# EAGLE design touch (EAGLE 9.6.2)
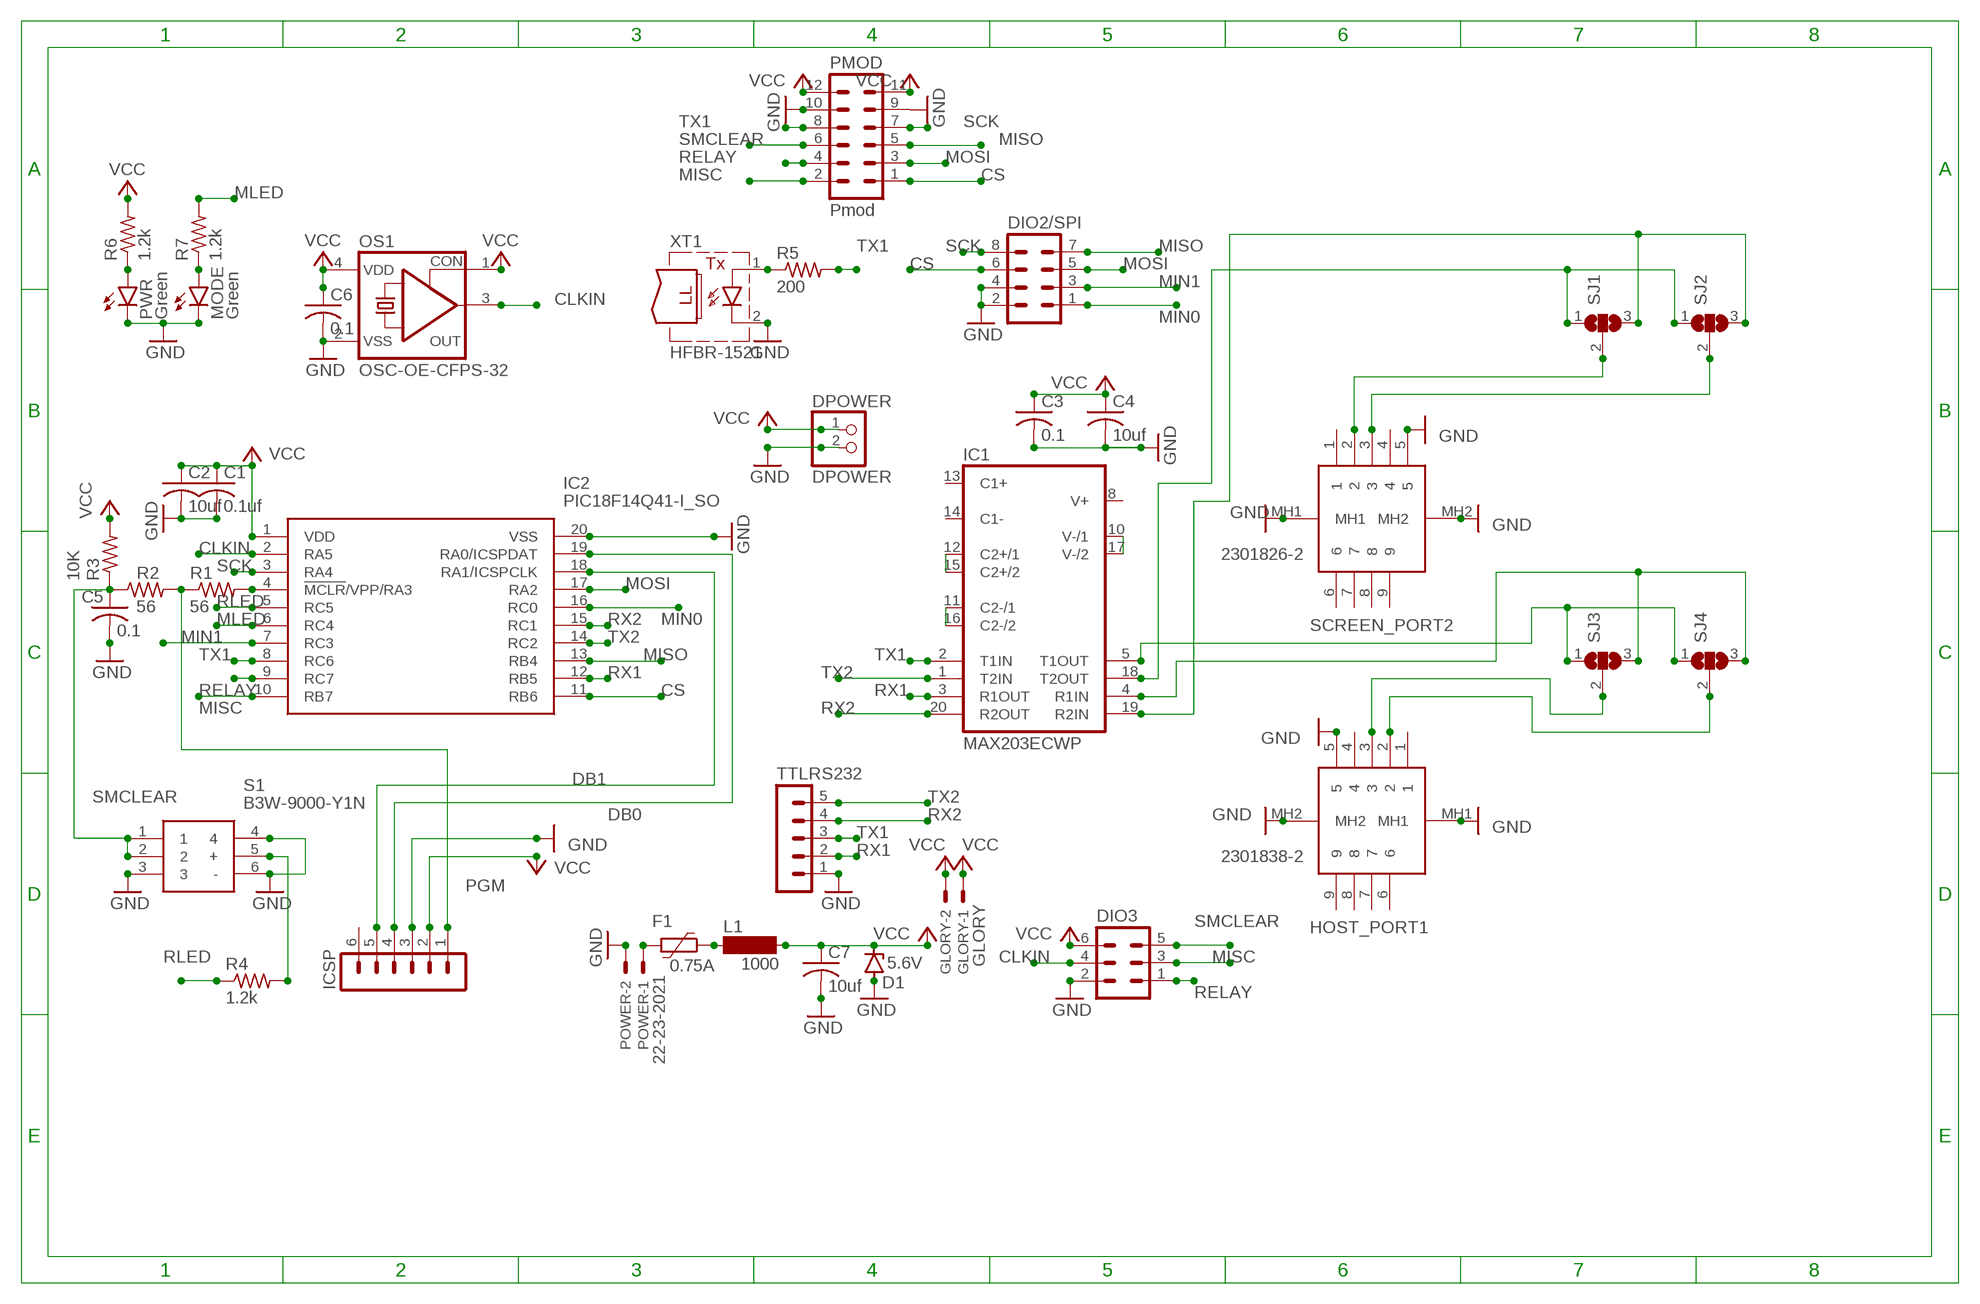
[diagram p0: schematic, sheet 1]

## Parts
C1  0.1uf  C-USC0805  [C0805]
C2  10uf  C-USC0805  [C0805]
C3  0.1  C-USC0805  [C0805]
C4  10uf  C-USC0805  [C0805]
C5  0.1  C-USC0805  [C0805]
C6  0.1  C-USC0805  [C0805]
C7  10uf  C-USC0805  [C0805]
D1  5.6V  ZENER-DIODESMB  [SMB]
DIO2/SPI  MA04-2  [MA04-2]
DIO3  MA03-2  [MA03-2]
DPOWER  DPOWER  PINHD-1X2  [1X02]
F1  0.75A  1206L075SL  [1206L]
GLORY  GLORY  22-23-2021  [22-23-2021]
HOST_PORT1  2301838-2  [23018382]
IC1  MAX203ECWP  [SO20L]
IC2  PIC18F14Q41-I_SO  [SOIC127P1030X265-20N]
ICSP  MA06-1  [MA06-1]
L1  1000  SM-1206  [SM-1206]
MODE  Green  LEDCHIPLED_1206  [CHIPLED_1206]
OS1  OSC-OE-CFPS-32  [7.2X5.2-4-PAD]
PMOD  Pmod  MA06-2  [MA06-2]
POWER  22-23-2021  [22-23-2021]
PWR  Green  LEDCHIPLED_1206  [CHIPLED_1206]
R1  56  R-US_R0805  [R0805]
R2  56  R-US_R0805  [R0805]
R3  10K  R-US_R0805  [R0805]
R4  1.2k  R-US_R0805  [R0805]
R5  200  R-US_R0805  [R0805]
R6  1.2k  R-US_R0805  [R0805]
R7  1.2k  R-US_R0805  [R0805]
S1  B3W-9000-Y1N  [B3W-9_1-LED]
SCREEN_PORT2  2301826-2  [23018262]
SJ1  SJ2W  [SJ_2]
SJ2  SJ2W  [SJ_2]
SJ3  SJ2W  [SJ_2]
SJ4  SJ2W  [SJ_2]
TTLRS232  MA05-1  [MA05-1]
XT1  HFBR-1521  [HFBR-15X3]

## Nets
CLKIN: DIO3.4 IC2.2(RA5) OS1.3(OUT)
CS: DIO2/SPI.6 IC2.11(RB6) PMOD.1
DB0: IC2.19(RA0/ICSPDAT) ICSP.4
DB1: IC2.18(RA1/ICSPCLK) ICSP.5
GND [icurrent]: C1.2 C2.2 C3.2 C4.2 C5.2 C6.2 C7.2 D1.A DIO2/SPI.2 DIO2/SPI.4 DIO3.2 DPOWER.2 HOST_PORT1.5 HOST_PORT1.MH1 HOST_PORT1.MH2 IC2.20(VSS) ICSP.3 MODE.C OS1.2(VSS) PMOD.9 PMOD.10 POWER.2 PWR.C S1.3 S1.4 S1.6(-) SCREEN_PORT2.5 SCREEN_PORT2.MH1 SCREEN_PORT2.MH2 TTLRS232.1 XT1.2(C)
MIN0: DIO2/SPI.1 IC2.16(RC0)
MIN1: DIO2/SPI.3 IC2.7(RC3)
MISC: DIO3.3 IC2.10(RB7) PMOD.2
MISO: DIO2/SPI.7 IC2.13(RB4) PMOD.5
MLED: IC2.6(RC4) R7.2
MOSI: DIO2/SPI.5 IC2.17(RA2) PMOD.3
N$1: SCREEN_PORT2.3 SJ2.2
N$2: SCREEN_PORT2.2 SJ1.2
N$3: HOST_PORT1.2 SJ4.2
N$4: HOST_PORT1.3 SJ3.2
N$5: IC1.12(C2+/1) IC1.15(C2+/2)
N$6: IC1.11(C2-/1) IC1.16(C2-/2)
N$7: IC1.10(V-/1) IC1.17(V-/2)
N$8: IC1.5(T1OUT) SJ3.1 SJ4.1
N$9: IC1.4(R1IN) SJ3.3 SJ4.3
N$11: IC1.18(T2OUT) SJ1.1 SJ2.1
N$12: IC1.19(R2IN) SJ1.3 SJ2.3
N$14: IC2.4(!MCLR!/VPP/RA3) R1.2
N$16 [icurrent]: F1.2 POWER.1
N$17: MODE.A R7.1
N$18: R4.2 S1.5(+)
N$19: R5.1 XT1.1(A)
N$20 [icurrent]: F1.1 L1.1
N$21: PWR.A R6.1
PGM: ICSP.1 R1.1 R2.2
RELAY: DIO3.1 IC2.9(RC7) PMOD.4
RLED: IC2.5(RC5) R4.1
RX1: IC1.3(R1OUT) IC2.12(RB5) TTLRS232.2
RX2: IC1.20(R2OUT) IC2.15(RC1) TTLRS232.4
SCK: DIO2/SPI.8 IC2.3(RA4) PMOD.7
SMCLEAR: C5.1 DIO3.5 PMOD.6 R2.1 R3.1 S1.1 S1.2
TX1: IC1.2(T1IN) IC2.8(RC6) PMOD.8 R5.2 TTLRS232.3
TX2: IC1.1(T2IN) IC2.14(RC2) TTLRS232.5
VCC [icurrent]: C1.1 C2.1 C3.1 C4.1 C6.1 C7.1 D1.C DIO3.6 DPOWER.1 GLORY.1 GLORY.2 IC2.1(VDD) ICSP.2 L1.2 OS1.1(CON) OS1.4(VDD) PMOD.11 PMOD.12 R3.2 R6.2
Unconnected: HOST_PORT1.1 HOST_PORT1.4 HOST_PORT1.6 HOST_PORT1.7 HOST_PORT1.8 HOST_PORT1.9 IC1.8(V+) IC1.13(C1+) IC1.14(C1-) ICSP.6 SCREEN_PORT2.1 SCREEN_PORT2.4 SCREEN_PORT2.6 SCREEN_PORT2.7 SCREEN_PORT2.8 SCREEN_PORT2.9

## Power pins joined to a net without a drawn wire
GND: IC1.6(GND) IC1.9(GND)
VCC: IC1.7(VCC)

## Library data of the parts
C1-C7 = rcl:C-US: CAPACITOR, American symbol; SPICEPREFIX: C
D1 = diode:ZENER-DIODE: Z-Diode
DIO2/SPI = con-lstb:MA04-2: PIN HEADER; OC_FARNELL: unknown; OC_NEWARK: unknown
DIO3 = con-lstb:MA03-2: PIN HEADER; OC_FARNELL: unknown; OC_NEWARK: unknown
DPOWER = pinhead:PINHD-1X2: PIN HEADER
F1 = polyfuse-smd_10:?: Polyfuse Resettable PTC Source: http://www.littelfuse.com/products/resettable-ptcs.aspx; MF: Littelfuse; MPN: 1206L075SL; OC_FARNELL: unknown; OC_NEWARK: 91T3236
GLORY POWER = con-molex:22-23-2021: .100" (2.54mm) Center Header - 2 Pin; MF: MOLEX; MPN: 22-23-2021; OC_FARNELL: 1462926; OC_NEWARK: 25C3832
HOST_PORT1 = SamacSys_Parts:2301838-2: TE CONNECTIVITY - 2301838-2 - D Sub Connector, DB9, Standard, Receptacle, 9 Contacts, DE, Solder Source: Datasheet <https://www.te.com/global-en/product-2301838-2.datasheet.pdf>; DESCRIPTION: TE CONNECTIVITY - 2301838-2 - D Sub Connector, DB9, Standard, Receptacle, 9 Contacts, DE, Solder; HEIGHT: mm; MANUFACTURER_NAME: TE Connectivity; MANUFACTURER_PART_NUMBER: 2301838-2; MOUSER_PART_NUMBER: 571-2301838-2; MOUSER_PRICE-STOCK: https://www.mouser.co.uk/ProductDetail/TE-Connectivity/2301838-2?qs=YCa%2FAAYMW00TbWYD0LSiFQ%3D%3D
IC1 = maxim:MAX203ECWP: RS232 TRANSCEIVER; MPN: MAX203ECWP+G36; OC_FARNELL: 1224204; OC_NEWARK: 89K3435
IC2 = SamacSys_Parts:PIC18F14Q41-I_SO: 8-bit Microcontrollers - MCU Op Amp, 16KB Flash, 1K RAM, 512 EEPROM, 12b ADCC, 8b DAC, DMA, 16-bit PWM, PPS, UART, SPI/I2C Source: Datasheet <https://componentsearchengine.com/Datasheets/2/PIC18F14Q41-I_SO.pdf>; DESCRIPTION: 8-bit Microcontrollers - MCU Op Amp, 16KB Flash, 1K RAM, 512 EEPROM, 12b ADCC, 8b DAC, DMA, 16-bit PWM, PPS, UART, SPI/I2C; HEIGHT: 2.65mm; MANUFACTURER_NAME: Microchip; MANUFACTURER_PART_NUMBER: PIC18F14Q41-I/SO; MOUSER_PART_NUMBER: 579-PIC18F14Q41-I/SO; MOUSER_PRICE-STOCK: https://www.mouser.co.uk/ProductDetail/Microchip-Technology/PIC18F14Q41-I-SO?qs=W%2FMpXkg%252BdQ5jNCMT7LkJWg%3D%3D
ICSP = con-lstb:MA06-1: PIN HEADER; OC_FARNELL: unknown; OC_NEWARK: unknown
L1 = inductor-neosid:SM-1206: INDUCTOR SMD chip inductor; OC_FARNELL: unknown; OC_NEWARK: unknown
MODE PWR = led:LED: LED OSRAM: - CHIPLED LG R971, LG N971, LY N971, LG Q971, LY Q971, LO R971, LY R971 LH N974, LH R974 LS Q976, LO Q976, LY Q976 LO Q996 - Hyper CHIPLED LW Q18S LB Q993, LB Q99A, LB R99A - SideLED LS A670, LO A670, LY A670, LG A670, LP A670 LB A673, LV A673, LT A673, LW A673 LH A674 LY A675 LS A676, LA A676, LO A676, LY A676, LW A676 LS A679, LY A679, LG A679 - Hyper Micro SIDELED® LS Y876, LA Y876, LO Y876, LY Y876 LT Y87S - SmartLED LW L88C, LW L88S LB L89C, LB L89S, LG L890 LS L89K, LO L89K, LY L89K LS L896, LA L896, LO L896, LY L896 - TOPLED LS T670, LO T670, LY T670, LG T670, LP T670 LSG T670, LSP T670, LSY T670, LOP T670, LYG T670 LG T671, LOG T671, LSG T671 LB T673, LV T673, LT T673, LW T673 LH T674 LS T676, LA T676, LO T676, LY T676, LB T676, LH T676, LSB T676, LW T676 LB T67C, LV T67C, LT T67C, LS T67K, LO T67K, LY T67K, LW E67C LS E67B, LA E67B, LO E67B, LY E67B, LB E67C, LV E67C, LT E67C LW T67C LS T679, LY T679, LG T679 LS T770, LO T770, LY T770, LG T770, LP T770 LB T773, LV T773, LT T773, LW T773 LH T774 LS E675, LA E675, LY E675, LS T675 LS T776, LA T776, LO T776, LY T776, LB T776 LHGB T686 LT T68C, LB T68C - Hyper Mini TOPLED® LB M676 - Mini TOPLED Santana® LG M470 LS M47K, LO M47K, LY M47K Source: http://www.osram.convergy.de LUXEON: - LUMILED® LXK2-PW12-R00, LXK2-PW12-S00, LXK2-PW14-U00, LXK2-PW14-V00 LXK2-PM12-R00, LXK2-PM12-S00, LXK2-PM14-U00 LXK2-PE12-Q00, LXK2-PE12-R00, LXK2-PE12-S00, LXK2-PE14-T00, LXK2-PE14-U00 LXK2-PB12-K00, LXK2-PB12-L00, LXK2-PB12-M00, LXK2-PB14-N00, LXK2-PB14-P00, LXK2-PB14-Q00 LXK2-PR12-L00, LXK2-PR12-M00, LXK2-PR14-Q00, LXK2-PR14-R00 LXK2-PD12-Q00, LXK2-PD12-R00, LXK2-PD12-S00 LXK2-PH12-R00, LXK2-PH12-S00 LXK2-PL12-P00, LXK2-PL12-Q00, LXK2-PL12-R00 Source: www.luxeon.com KINGBRIGHT: KA-3528ASYC Source: www.kingbright.com
OS1 = IQD-Frequency-Products:OSC-OE: OSCILLATOR WITH OE
PMOD = con-lstb:MA06-2: PIN HEADER; OC_FARNELL: unknown; OC_NEWARK: unknown
R1-R7 = rcl:R-US_: RESISTOR, American symbol; SPICEPREFIX: R
S1 = SamacSys_Parts:B3W-9000-Y1N: Illuminated Tactile Switches Illuminated Ylw LED White Cap Source: Datasheet <http://www.mouser.com/ds/2/307/en-b3w-9-11824.pdf>; ALLIED_NUMBER: 70176005; ALLIED_PRICE-STOCK: https://www.alliedelec.com/omron-electronic-components-b3w-9000-y1n/70176005/; DESCRIPTION: Illuminated Tactile Switches Illuminated Ylw LED White Cap; HEIGHT: mm; MANUFACTURER_NAME: Omron Electronics; MANUFACTURER_PART_NUMBER: B3W-9000-Y1N; MOUSER_PART_NUMBER: 653-B3W-9000-Y1N; MOUSER_PRICE-STOCK: https://www.mouser.com/Search/Refine.aspx?Keyword=653-B3W-9000-Y1N; RS_PART_NUMBER: 0492777P; RS_PRICE-STOCK: http://uk.rs-online.com/web/p/products/0492777P
SCREEN_PORT2 = SamacSys_Parts:2301826-2: D-Sub Standard Connectors AMPL PLUG HD20 VERT 9P, B/L,4-40 S/LOC Source: Datasheet <https://componentsearchengine.com/Datasheets/1/2301826-2.pdf>; DESCRIPTION: D-Sub Standard Connectors AMPL PLUG HD20 VERT 9P, B/L,4-40 S/LOC; HEIGHT: 12.48mm; MANUFACTURER_NAME: TE Connectivity; MANUFACTURER_PART_NUMBER: 2301826-2; MOUSER_PART_NUMBER: 571-2301826-2; MOUSER_PRICE-STOCK: https://www.mouser.co.uk/ProductDetail/TE-Connectivity/2301826-2?qs=YCa%2FAAYMW01innH%2F05o6MQ%3D%3D
SJ1-SJ4 = jumper:SJ2W: SMD solder JUMPER
TTLRS232 = con-lstb:MA05-1: PIN HEADER; OC_FARNELL: unknown; OC_NEWARK: unknown
XT1 = fiber-optic-hp:HFBR-1521: TRANSMITTER low cost miniature fiber optic component, 5-MBd high performance link, vertical; MF: AGILENT TECHNOLOGIES; MPN: HFBR-1521; OC_FARNELL: 1173128; OC_NEWARK: 06F6050

## Net classes
1 icurrent: width 0.305 mm

## Board
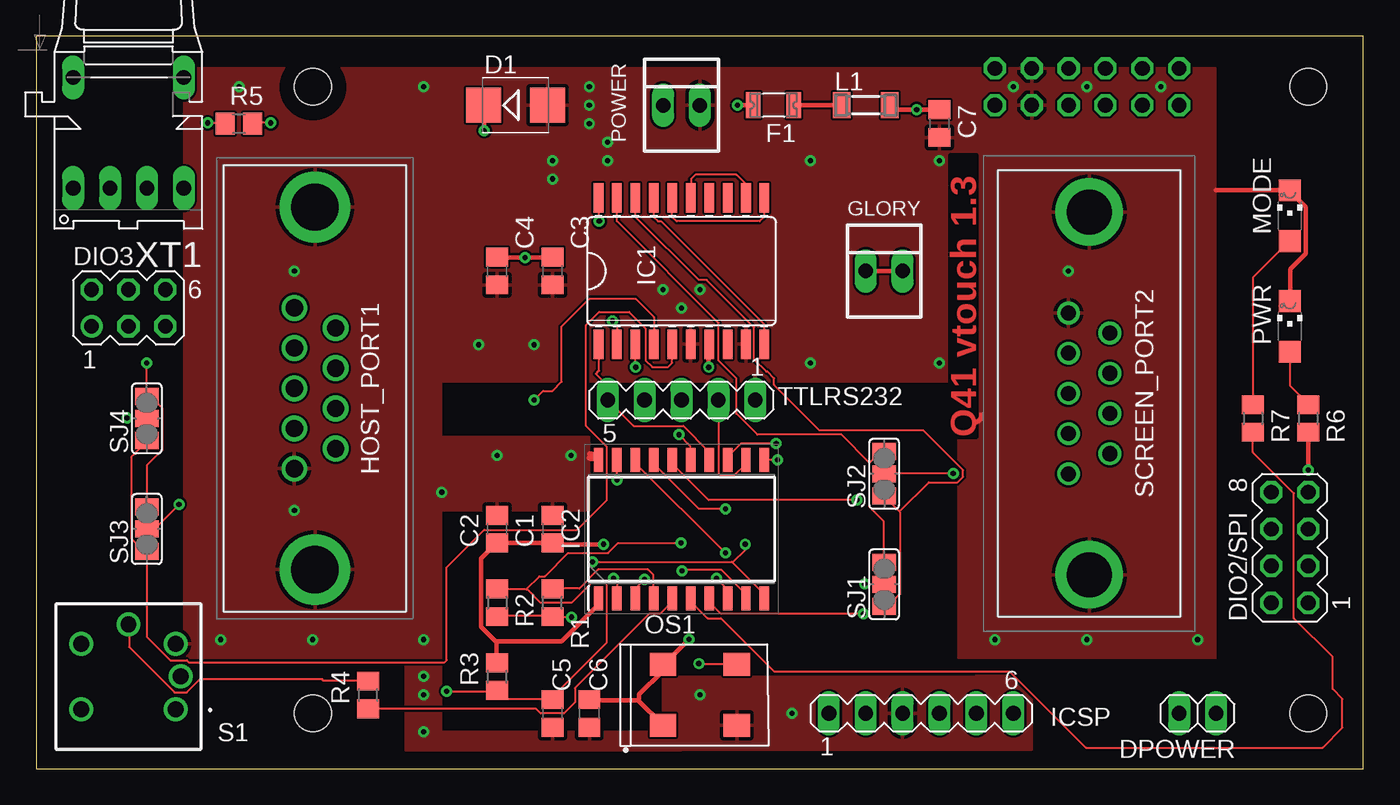
[diagram p1: board, top side]
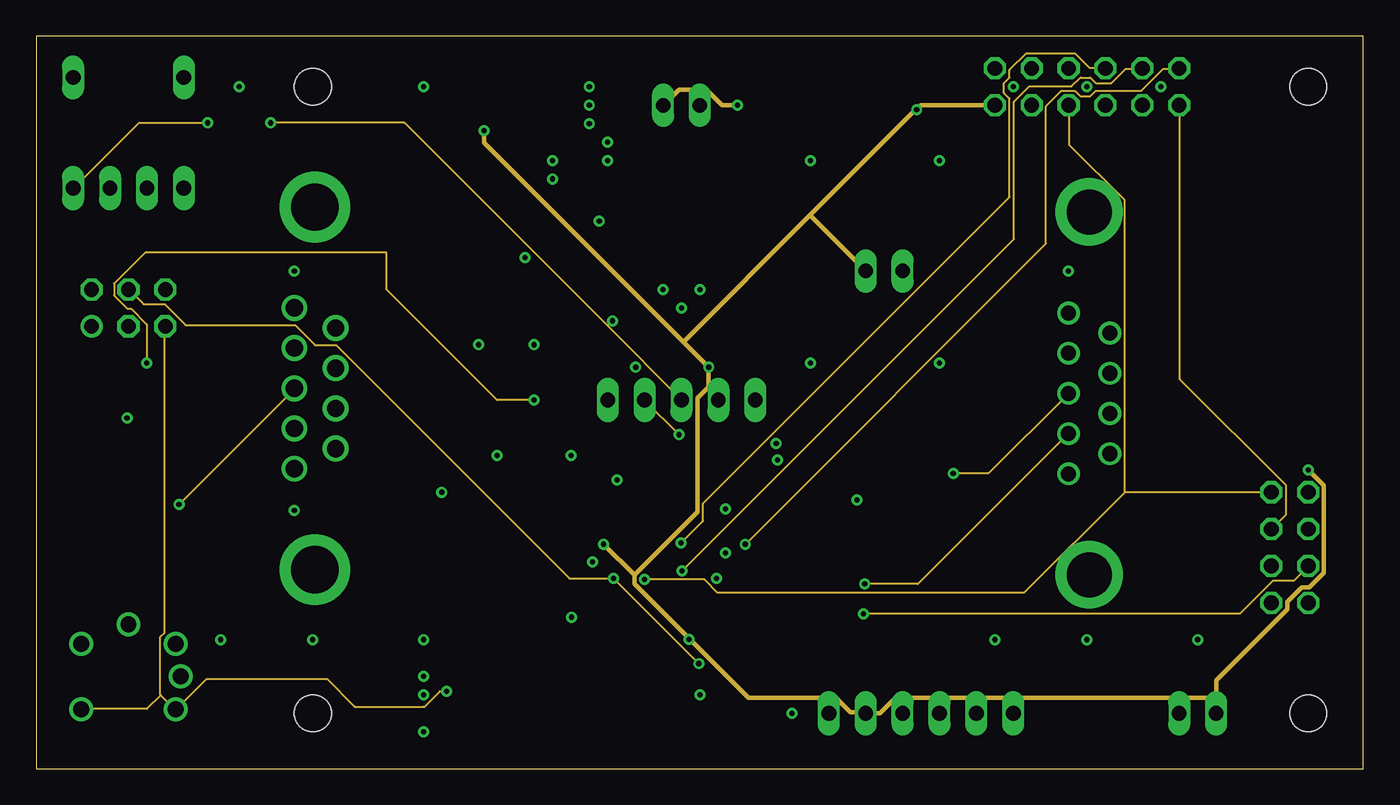
[diagram p2: board, inner layer Route2]
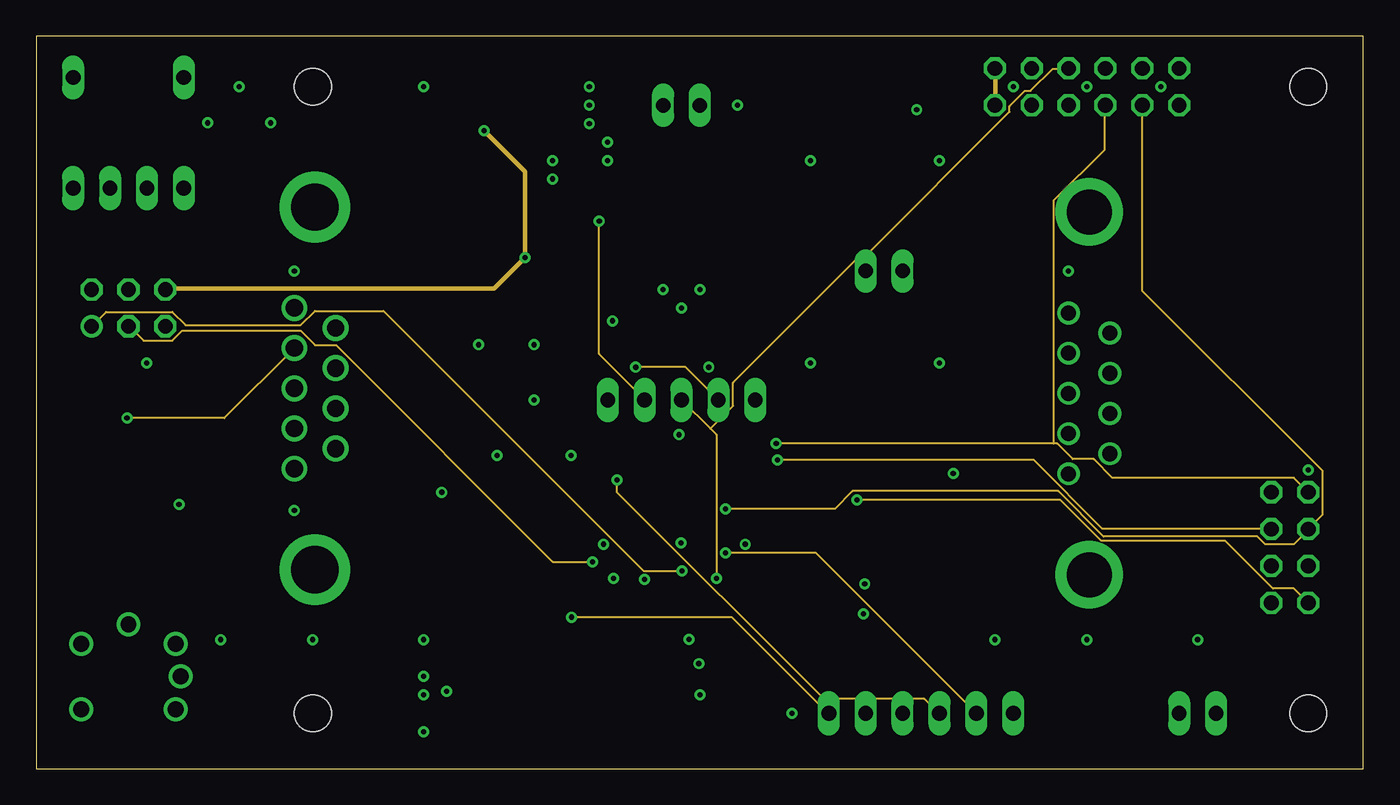
[diagram p3: board, inner layer Route15]
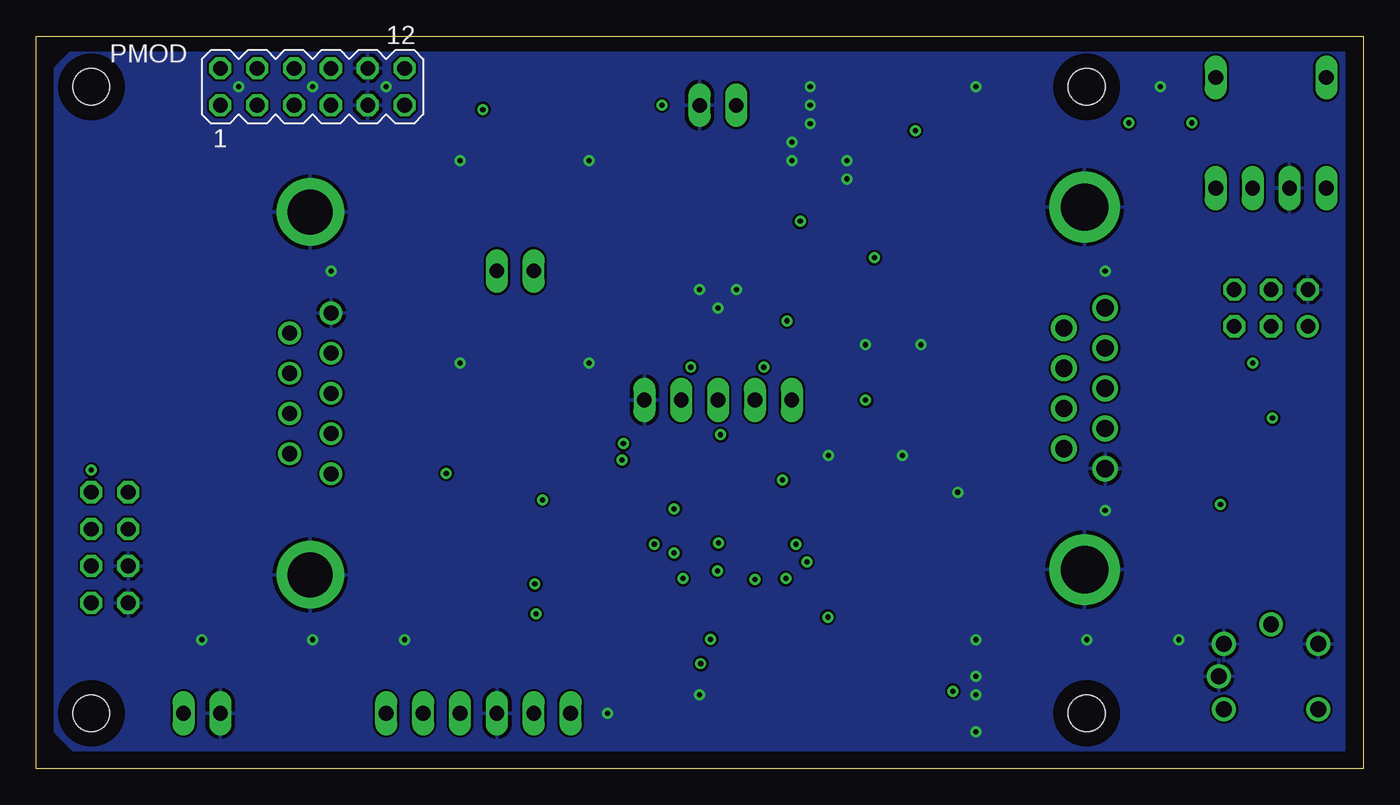
[diagram p4: board, bottom side, seen from below]

Size 91.42 x 50.47 mm. Coordinates in mm from the lower left corner, seen from the top.
Outline: 0,0 91.42,0 91.42,50.47 0,50.47 0,0
Copper layers (1+2*15+16): Top 0.035mm / dielectric 1.5mm / Route2 0.035mm / dielectric 0.15mm / Route15 0.035mm / dielectric 0.2mm / Bottom 0.035mm
Design rules "default *": minimum track width 6mil, minimum drill 0.35mm, track to track 6mil, track to pad 6mil, pad to pad 6mil, via to via 6mil, smd to smd 6mil, copper to edge 40mil, drill to drill 6mil, minimum pad ring 10mil, minimum via ring 8mil, stop-mask expansion 4mil, vias tented up to drill 0mil, thermal gap 10mil
Holes 2.54 mm at 19.05,46.99 19.05,3.81 87.63,3.81 87.63,46.99

### Footprints (pad centres in the part's own frame; a part is rotated, then mirrored left to right if it is on the bottom)
C0805 = smd 1.3 x 1.5: 1 -0.95,0; 2 0.95,0
SMB = smd 2.4 x 2.4: A 2.2,0; C -2.2,0
MA04-2 = drill 1.016 octagon: 1 -3.81,-1.27; 2 -3.81,1.27; 3 -1.27,-1.27; 4 -1.27,1.27; 5 1.27,-1.27; 6 1.27,1.27; 7 3.81,-1.27; 8 3.81,1.27
MA03-2 = drill 1.016: 1 -2.54,-1.27 | drill 1.016 octagon: 2 -2.54,1.27; 3 0,-1.27; 4 0,1.27; 5 2.54,-1.27; 6 2.54,1.27
1X02 = drill 1.016 long: 1 -1.27,0; 2 1.27,0
1206L = smd 1 x 1.8: 1 -1.4,0; 2 1.4,0
22-23-2021 = drill 1 long: 1 -1.27,0; 2 1.27,0
23018382 = drill 1.19 pad 1.785: 1 0,0; 2 -2.77,0; 3 -5.54,0; 4 -8.31,0; 5 -11.08,0; 6 -1.385,-2.84; 7 -4.155,-2.84; 8 -6.925,-2.84; 9 -9.695,-2.84 | drill 3.25 pad 4.875: MH1 6.955,-1.42; MH2 -18.035,-1.42
SO20L = smd 0.66 x 2.032: 1 -5.715,-5.029; 2 -4.445,-5.029; 3 -3.175,-5.029; 4 -1.905,-5.029; 5 -0.635,-5.029; 6 0.635,-5.029; 7 1.905,-5.029; 8 3.175,-5.029; 9 4.445,-5.029; 10 5.715,-5.029; 11 5.715,5.029; 12 4.445,5.029; 13 3.175,5.029; 14 1.905,5.029; 15 0.635,5.029; 16 -0.635,5.029; 17 -1.905,5.029; 18 -3.175,5.029; 19 -4.445,5.029; 20 -5.715,5.029
SOIC127P1030X265-20N = smd 1.65 x 0.65: 1 -4.775,5.715; 2 -4.775,4.445; 3 -4.775,3.175; 4 -4.775,1.905; 5 -4.775,0.635; 6 -4.775,-0.635; 7 -4.775,-1.905; 8 -4.775,-3.175; 9 -4.775,-4.445; 10 -4.775,-5.715; 11 4.775,-5.715; 12 4.775,-4.445; 13 4.775,-3.175; 14 4.775,-1.905; 15 4.775,-0.635; 16 4.775,0.635; 17 4.775,1.905; 18 4.775,3.175; 19 4.775,4.445; 20 4.775,5.715
MA06-1 = drill 1.016 long: 1 -6.35,0; 2 -3.81,0; 3 -1.27,0; 4 1.27,0; 5 3.81,0; 6 6.35,0
SM-1206 = smd 1.2 x 1.8: 1 -1.65,0; 2 1.65,0
CHIPLED_1206 = smd 1.5 x 1.5: A 0,-1.75; C 0,1.75
7.2X5.2-4-PAD = smd 1.8 x 1.6: 1 -2.54,-2.1; 2 2.54,-2.1; 3 2.54,2.1; 4 -2.54,2.1
MA06-2 = drill 1.016 octagon: 1 -6.35,-1.27; 2 -6.35,1.27; 3 -3.81,-1.27; 4 -3.81,1.27; 5 -1.27,-1.27; 6 -1.27,1.27; 7 1.27,-1.27; 8 1.27,1.27; 9 3.81,-1.27; 10 3.81,1.27; 11 6.35,-1.27; 12 6.35,1.27
R0805 = smd 1.3 x 1.5: 1 -0.95,0; 2 0.95,0
B3W-9_1-LED = drill 1.1 pad 1.65: 1 3.25,-2.25; 2 -3.25,-2.25; 3 3.25,2.25; 4 -3.25,2.25; 5 0,3.6; 6 3.6,0
23018262 = drill 1.04 pad 1.56: 1 0,0; 2 2.77,0; 3 5.54,0; 4 8.31,0; 5 11.08,0; 6 1.385,-2.84; 7 4.155,-2.84; 8 6.925,-2.84; 9 9.695,-2.84 | drill 3.1 pad 4.65: MH1 -6.955,-1.42; MH2 18.035,-1.42
SJ_2 = smd 1.168 x 1.6: 1 -1.524,0; 2 0,0; 3 1.524,0
MA05-1 = drill 1.016 long: 1 -5.08,0; 2 -2.54,0; 3 0,0; 4 2.54,0; 5 5.08,0
HFBR-15X3 = drill 1.016 long: 1 3.81,9.525; 2 1.27,9.525; 3 -1.27,9.525; 4 -3.81,9.525; 5 -3.81,1.905; 8 3.81,1.905

### Placement (x,y rotation side)
C1  35.56,16.51 90 top
C2  31.75,16.51 90 top
C3  35.56,34.29 270 top
C4  31.75,34.29 270 top
C5  35.56,3.81 270 top
C6  38.1,3.81 270 top
C7  62.23,44.45 270 top
D1  33.02,45.72 0 top
DIO2/SPI  86.36,15.24 90 top
DIO3  6.35,31.75 0 top
DPOWER  80.01,3.81 180 top
F1  50.8,45.72 180 top
GLORY  58.42,34.29 0 top
HOST_PORT1  17.78,31.75 90 top
IC1  44.45,34.29 0 top
IC2  44.45,16.51 90 top
ICSP  60.96,3.81 0 top
L1  57.15,45.72 0 top
MODE  86.36,38.1 0 top
OS1  45.72,5.08 0 top
PMOD  72.39,46.99 0 bottom
POWER  44.45,45.72 0 top
PWR  86.36,30.48 0 top
R1  35.56,11.43 90 top
R2  31.75,11.43 270 top
R3  31.75,6.35 90 top
R4  22.86,5.08 90 top
R5  13.97,44.45 0 top
R6  87.63,24.13 270 top
R7  83.82,24.13 270 top
S1  6.35,6.35 0 top
SCREEN_PORT2  71.12,20.32 90 top
SJ1  58.42,12.7 90 top
SJ2  58.42,20.32 90 top
SJ3  7.62,16.51 90 top
SJ4  7.62,24.13 90 top
TTLRS232  44.45,25.4 180 top
XT1  6.35,49.53 180 top

### Tracks (layer width: path | path; a pad name or v marks a point on that pad's centre or on a via)
CLKIN  (via drill 0.35)
  Top 0.152: IC2.2 40.01,12.88 v39.78,13.11 | v45.64,7.24 48.23,7.24 OS1.3
  Route2 0.152: DIO3.4 6.4,32.99 7.39,32 8.84,32 10.29,30.56 17.83,30.56 19.2,29.18 20.65,29.18 36.73,13.11 v39.78,13.11 v45.64,7.24
CS  (via drill 0.35)
  Top 0.152: v51.05,21.26 50.22,21.26 IC2.11
  Route2 0.152: DIO2/SPI.6 86.11,17.53 86.11,19.51 78.79,26.82 78.79,45.72 PMOD.1
  Route15 0.152: v51.05,21.26 68.73,21.26 73.46,16.54 85.04,16.54 DIO2/SPI.6
DB0  (via drill 0.35)
  Top 0.152: v40.01,19.89 IC2.19
  Route15 0.152: v40.01,19.89 40.01,19.05 54.25,4.8 61.19,4.8 62.18,3.81 ICSP.4
DB1  (via drill 0.35)
  Top 0.152: v47.47,14.86 41.3,21.03 41.3,21.26 IC2.18
  Route15 0.152: v47.47,14.86 53.72,14.86 ICSP.5
GND  (via drill 0.35)
  Top 0.305: IC2.20 38.71,21.34 38.18,21.34 38.18,21.57 38.25,21.57 38.33,21.49 38.33,21.41 38.25,21.41 38.25,21.49 38.33,21.57 38.33,21.64 38.25,21.72 38.1,21.72 38.08,21.36 | PWR.C 86.41,32.23 86.41,34.44 87.48,35.51 87.48,38.71 86.41,39.78 MODE.C 86.26,39.85 81.28,39.85
  other vias: 31.75,21.59 36.83,21.59 26.67,5.08 52.07,3.81 71.12,34.29 17.78,34.29 45.72,33.02 35.56,41.91 39.37,41.91 35.56,40.64 39.37,43.18 26.67,8.89 66.04,8.89 80.01,8.89 77.47,46.99 12.7,8.89 13.97,46.99 17.78,17.78 67.31,46.99 26.67,46.99 26.67,6.35 19.05,8.89 72.39,46.99 72.39,8.89 53.34,27.94 43.18,33.02 34.29,29.21 62.23,27.94 44.45,31.75 62.23,41.91 38.1,46.99 38.1,45.72 38.1,44.45 26.67,2.54 27.94,19.05 30.48,29.21 45.72,5.08 53.34,41.91
  pour Top: 36.83,30.48 36.83,41.91 35.56,43.18 17.78,43.18 15.24,40.64 15.24,35.56 16.51,34.29 27.94,34.29 27.94,30.48
  pour Top (rank 6): 10.16,48.26 10.16,7.62 27.94,7.62 27.94,26.67 63.5,26.67 63.5,7.62 81.28,7.62 81.28,48.26
  pour Top: 43.18,6.35 64.77,6.35 64.77,7.62 68.58,7.62 68.58,1.27 43.18,1.27
  pour Top: 26.67,17.78 38.1,17.78 38.1,22.86 26.67,22.86
  pour Top: 25.4,8.89 25.4,1.27 44.45,1.27 44.45,2.54 27.94,2.54 27.94,8.89
  pour Bottom: 1.27,49.53 88.9,49.53 90.17,48.26 90.17,2.54 88.9,1.27 1.27,1.27
  pour Top: 25.4,8.89 25.4,1.27 44.45,1.27 44.45,2.54 27.94,2.54 27.94,8.89
MIN0  (via drill 0.35)
  Top 0.152: IC2.16 43.81,21.03 46.33,18.52 v56.54,18.52
  Route15 0.152: v56.54,18.52 70.56,18.52 73.38,15.7 81.92,15.7 85.19,12.42 86.64,12.42 DIO2/SPI.1
MIN1  (via drill 0.35)
  Top 0.152: v57,10.67 47.17,10.67 46.41,11.43 46.41,11.73 IC2.7
  Route2 0.152: v57,10.67 82.91,10.67 85.19,12.95 86.64,12.95 87.63,13.95 DIO2/SPI.3
MISC  (via drill 0.35)
  Top 0.152: 47.97,14.21 47.93,14.25 v38.33,14.25 | 47.97,14.21 50.14,12.04 50.14,11.81 IC2.10 | v48.84,15.47 48.84,15.09 47.97,14.21
  Route2 0.152: v48.84,15.47 69.57,36.2 69.57,45.64 70.64,46.71 71.55,46.71 71.93,46.33 72.62,46.33 73,46.71 76.12,46.71 77.65,48.23 78.72,48.23 PMOD.2
  Route15 0.152: v38.33,14.25 35.59,14.25 20.65,29.18 19.2,29.18 18.21,30.18 10.06,30.18 9.37,29.49 7.39,29.49 6.4,30.48 DIO3.3
MISO  (via drill 0.35)
  Top 0.152: IC2.13 47.62,21.49 48.54,22.4 v50.98,22.4
  Route15 0.152: 70.1,22.4 70.33,22.4 71.4,21.34 72.85,21.34 74.14,20.04 86.64,20.04 DIO2/SPI.7 | 70.1,22.4 v50.98,22.4 | 70.1,22.4 70.1,39.17 73.61,42.67 73.61,45.72 PMOD.5
MLED
  Top 0.152: R7.2 83.82,21.79 86.64,18.97 86.64,10.36 89.31,7.7 89.31,5.49 89.99,4.8 89.99,2.82 88.62,1.45 72.31,1.45 67.06,6.71 50.83,6.71 47.17,10.36 46.25,10.36 45.11,11.51 45.11,11.73 IC2.6
MOSI  (via drill 0.35)
  Top 0.152: v47.47,17.91 45.64,17.91 42.6,20.95 42.6,21.26 IC2.17
  Route15 0.152: v47.47,17.91 55.02,17.91 56.24,19.13 70.41,19.13 73.53,16 84.12,16 84.66,15.47 86.64,15.47 87.63,16.46 DIO2/SPI.5 87.63,16.54 88.62,17.53 88.62,20.5 76.2,32.92 PMOD.3
N$1  (via drill 0.35)
  Top 0.152: v63.17,20.34 58.45,20.34 SJ2.2
  Route2 0.152: v63.17,20.34 65.61,20.34 71.09,25.83 SCREEN_PORT2.3
N$2  (via drill 0.35)
  Top 0.152: v57.07,12.72 58.37,12.72 SJ1.2
  Route2 0.152: v57.07,12.72 60.73,12.72 71.09,23.09 SCREEN_PORT2.2
N$3  (via drill 0.35)
  Top 0.152: v6.25,24.16 7.62,24.16 SJ4.2
  Route15 0.152: v6.25,24.16 12.95,24.16 17.75,28.96 HOST_PORT1.2
N$4  (via drill 0.35)
  Top 0.152: v9.83,18.21 8.15,16.54 7.62,16.54 SJ3.2
  Route2 0.152: v9.83,18.21 17.75,26.14 HOST_PORT1.3
N$5
  Top 0.152: IC1.15 45.11,39.32 45.11,40.62 45.41,40.92 48.23,40.92 48.84,40.31 48.84,39.32 IC1.12
N$6
  Top 0.152: IC1.16 43.81,38.02 44.12,37.72 49.84,37.72 50.14,38.02 50.14,39.32 IC1.11
N$7
  Top 0.152: IC1.10 50.14,29.26 50.14,30.63 43.05,37.72 42.82,37.72 42.52,38.02 42.52,39.32 IC1.17
N$8
  Top 0.152: SJ4.1 7.62,22.55 6.55,21.49 6.55,15.85 7.39,15.01 7.62,15.01 SJ3.1 7.62,9.07 9.22,7.47 10.36,7.47 10.52,7.32 28.12,7.32 28.27,7.47 28.27,13.87 30.86,16.46 37.26,16.46 39.32,18.52 39.32,22.17 37.87,23.62 37.87,30.56 38.79,31.47 40.84,31.47 41.99,30.33 41.99,28.12 42.44,27.66 43.51,27.66 43.81,27.96 IC1.5
N$9  (via drill 0.35)
  Top 0.152: SJ3.3 7.62,20.88 8.69,21.95 8.69,24.84 7.92,25.6 7.85,25.6 | 7.85,25.6 7.62,25.6 SJ4.3 | 7.85,25.6 SJ4.3 | IC1.4 42.55,31.11 41.27,32.38 38.1,32.38 36.2,30.48 36.2,26.67 35.56,26.04 34.92,26.04 v34.29,25.4 | SJ4.3 v7.62,27.94
  Route2 0.152: v34.29,25.4 31.75,25.4 24.13,33.02 24.13,35.56 7.49,35.56 5.36,33.43 5.36,32.61 6.27,31.7 6.53,31.7 7.62,30.61 v7.62,27.94
N$11
  Top 0.152: 59.47,17.72 58.45,18.75 SJ2.1 | 59.47,17.72 59.51,17.68 59.51,12.04 58.67,11.2 58.45,11.2 SJ1.1 | 59.47,17.72 61.49,19.74 63.48,19.74 63.86,20.12 63.86,20.57 61.11,23.32 53.95,23.32 50.83,26.44 50.83,26.9 50.37,27.36 50.29,27.36 49.45,28.19 49.45,30.4 46.18,33.68 45.64,33.68 41.3,38.02 41.3,39.32 IC1.18
N$12
  Top 0.152: 57.42,21.07 58.14,21.79 58.37,21.79 SJ2.3 | 57.42,21.07 57.38,21.03 57.38,18.06 58.37,17.07 58.37,14.25 SJ1.3 | IC1.19 40.01,37.72 47.02,30.71 47.02,28.12 48.23,26.9 48.23,24.46 49.68,23.01 55.47,23.01 57.42,21.07
N$14
  Top 0.152: R1.2 35.59,12.42 37.41,12.42 38.71,13.72 42.14,13.72 42.52,13.34 42.52,11.81 IC2.4
N$16  (via drill 0.35)
  Top 0.305: v48.31,45.72 F1.2
  Route2 0.305: v48.31,45.72 47.24,45.72 46.18,46.79 44.27,46.79 43.2,45.72 POWER.1
N$17
  Top 0.152: R7.1 83.82,33.83 86.33,36.35 MODE.A
N$18
  Top 0.152: S1.5 6.4,9.91 6.4,8.38 9.53,5.26 10.36,5.26 11.28,6.17 19.66,6.17 19.74,6.1 22.86,6.1 R4.2
N$19  (via drill 0.35)
  Top 0.152: v11.81,44.5 12.95,44.5 R5.1
  Route2 0.152: v11.81,44.5 7.09,44.5 2.59,40.01 XT1.1
N$20
  Top 0.305: L1.1 F1.1
N$21
  Top 0.152: PWR.A 86.41,28.73 86.41,26.36 87.63,25.15 R6.1
PGM  (via drill 0.35)
  Top 0.152: R2.2 31.77,10.52 35.51,10.52 R1.1 35.59,10.44 v36.88,10.44
  Route15 0.152: v36.88,10.44 47.93,10.44 54.56,3.81 ICSP.1
RELAY  (via drill 0.35)
  Top 0.152: v44.5,13.64 44.58,13.72 47.17,13.72 48.84,12.04 48.84,11.81 IC2.9
  Route2 0.152: v44.5,13.64 67.36,36.5 67.36,45.95 68.43,47.02 71.32,47.02 71.93,47.62 72.62,47.62 73,47.24 74.07,47.24 75.06,48.23 76.2,48.23 PMOD.4
  Route15 0.152: v44.5,13.64 41.83,13.64 23.93,31.55 19.2,31.55 18.21,30.56 10.29,30.56 9.37,31.47 4.8,31.47 DIO3.1
RLED
  Top 0.152: IC2.5 43.81,11.51 42.98,10.67 42.22,10.67 37.11,5.56 37.11,4.57 36.35,3.81 34.75,3.81 34.44,4.12 22.86,4.12 R4.1
RX1  (via drill 0.35)
  Top 0.152: IC2.12 48.84,21.26 48.84,20.95 48.08,20.19 47.17,20.19 47.02,20.34 47.02,25.38 TTLRS232.2 | v41.3,27.66 41.3,29.26 IC1.3
  Route15 0.152: v41.3,27.66 44.73,27.66 TTLRS232.2
RX2  (via drill 0.35)
  Top 0.152: v44.27,23.01 45.03,22.25 45.03,21.34 IC2.15 | v38.79,37.72 38.79,39.32 IC1.20
  Route2 0.152: v44.27,23.01 41.91,25.38 TTLRS232.4
  Route15 0.152: v38.79,37.72 38.79,28.57 41.91,25.45 TTLRS232.4
SCK  (via drill 0.35)
  Top 0.152: v41.91,13.03 41.3,12.42 41.3,11.81 IC2.3
  Route2 0.152: v41.91,13.03 46.02,13.03 46.94,12.12 68.05,12.12 74.98,19.05 | DIO2/SPI.8 74.98,19.05 | 74.98,19.05 74.98,39.17 71.17,42.98 71.17,45.72 PMOD.7
SMCLEAR  (via drill 0.35)
  Top 0.152: 33.76,12.34 33.83,12.34 34.75,11.43 36.88,11.43 38.25,12.8 39.17,12.8 39.32,12.65 39.32,8.69 35.51,4.88 C5.1 35.51,4.8 32.31,4.8 31.77,5.33 R3.1 31.7,5.33 v28.27,5.33 | 33.76,12.34 31.77,12.34 R2.1 | v44.42,15.54 40.08,15.54 39.4,14.86 36.65,14.86 35.05,13.26 34.67,13.26 33.76,12.34
  Route2 0.152: 8.57,5.07 9.53,4.12 S1.1 | 8.57,5.07 8.53,5.11 8.53,9.07 8.84,9.37 8.84,30.48 DIO3.5 | 8.57,5.07 7.62,4.12 3.12,4.12 S1.2 | v28.27,5.33 27.81,5.33 26.71,4.23 26.67,4.27 21.95,4.27 20.04,6.17 11.73,6.17 9.75,4.19 | 9.75,4.19 9.68,4.12 S1.1 | 9.75,4.19 S1.1 | v44.42,15.54 45.95,17.07 45.95,18.29 67.06,39.4 67.06,46.18 66.67,46.56 66.67,47.24 67.06,47.62 67.06,48.16 68.2,49.3 71.55,49.3 72.54,48.31 73.61,48.31 PMOD.6
TX1  (via drill 0.35)
  Top 0.152: v16.15,44.5 14.94,44.5 R5.2 | IC2.8 47.62,12.34 v46.86,13.11 | IC1.2 40.01,30.56 v39.7,30.86
  Route2 0.152: v16.15,44.5 25.38,44.5 39.36,30.52 | 39.36,30.52 44.42,25.45 TTLRS232.3 | 39.36,30.52 v39.7,30.86
  Route15 0.152: v46.86,13.11 46.86,23.01 46.44,23.43 | 46.44,23.43 44.5,25.38 TTLRS232.3 | 46.44,23.43 48.01,24.99 48.01,26.59 56.69,35.28 57.07,35.28 67.06,45.26 67.06,45.64 68.12,46.71 68.5,46.71 70.03,48.23 71.09,48.23 PMOD.8
TX2
  Top 0.152: IC2.14 46.33,21.34 46.33,21.87 44.58,23.62 41.15,23.62 TTLRS232.5 39.32,25.45 39.32,26.44 38.56,27.2 38.79,27.43 38.79,29.26 IC1.1
VCC  (via drill 0.35)
  Top 0.305: 31.7,8.69 31.7,7.32 R3.2 | 31.7,8.69 30.63,9.75 30.63,14.48 31.7,15.54 C2.1 31.85,15.54 35.51,15.54 C1.1 35.66,15.47 v39.09,15.47 | IC2.1 38.71,11.73 38.71,11.28 36.2,8.76 31.77,8.76 31.7,8.69 | 41.45,4.72 38.1,4.72 C6.1 | 41.45,4.72 43.13,3.05 OS1.1 | 41.45,4.72 41.53,4.8 41.53,5.11 43.13,6.71 43.13,7.16 OS1.4 43.28,7.24 v44.96,8.91 | C7.1 62.18,45.41 v60.66,45.41 59.13,45.41 58.83,45.72 L1.2 | C4.1 31.77,35.2 v33.68,35.2 35.51,35.2 C3.1 | v87.63,20.57 R6.2 | v46.33,27.66 46.33,29.26 IC1.7 | v30.86,43.97 30.86,45.72 D1.C | GLORY.2 GLORY.1
  Route2 0.305: v87.63,20.57 88.7,19.51 88.7,13.49 87.71,12.5 87.17,12.5 86.18,11.51 86.18,10.97 81.31,6.1 81.31,4.88 | 41.22,13.34 45.57,17.68 45.57,25.53 46.33,26.29 v46.33,27.66 44.58,29.41 | 41.22,13.34 41.22,12.72 45,8.95 | 45,8.95 49.07,4.88 55.09,4.88 56.08,3.89 57.07,3.89 ICSP.2 58.14,3.81 59.21,4.88 81.31,4.88 | v30.86,43.97 30.86,43.13 44.58,29.41 | 44.58,29.41 53.3,38.14 | 53.3,38.14 60.58,45.41 v60.66,45.41 60.96,45.72 PMOD.11 | v44.96,8.91 45,8.95 | 41.22,13.34 v39.09,15.47 | 53.3,38.14 GLORY.1 | 81.31,4.88 81.31,3.81 DPOWER.1
  Route15 0.305: v30.86,43.97 33.68,41.15 v33.68,35.2 31.55,33.07 8.91,33.07 DIO3.6 | PMOD.11 66.06,45.72 66.06,48.23 PMOD.12

### Text on the board
Top: Q41 vtouch 1.3